# Altium schematic sheet current amplifier 02.SchDoc: PHOTOELECTRIC EFFECT
size A3; ApprovedBy: NHOPPASIT S.; CheckedBy: NHOPPASIT S.; Author: NHOPPASIT S.; DrawnBy: NHOPPASIT S.; DocumentNumber: EE-01; Revision: 1; SheetNumber: 1; SheetTotal: 1; Size: A3; PageSetup: Record=PageOptions?CenterHorizontal=True?CenterVertical=True?PrintScale=0.96?XCorrection=1.00?YCorrection=1.00?PrintKind=0?BorderSize=5000000?LeftOffset=0?BottomOffset=0?Orientation=2?PaperLength=1000?PaperWidth=1000?Scale=100?PaperSource=7?PrintQuality=-4?MediaType=1?DitherType=10?PaperKind=A4?PrintScaleMode=1; DocumentName: PHOTOELECTRIC EFFECT SCH; ProjectName: PHOTOELECTRIC EFFECT 01
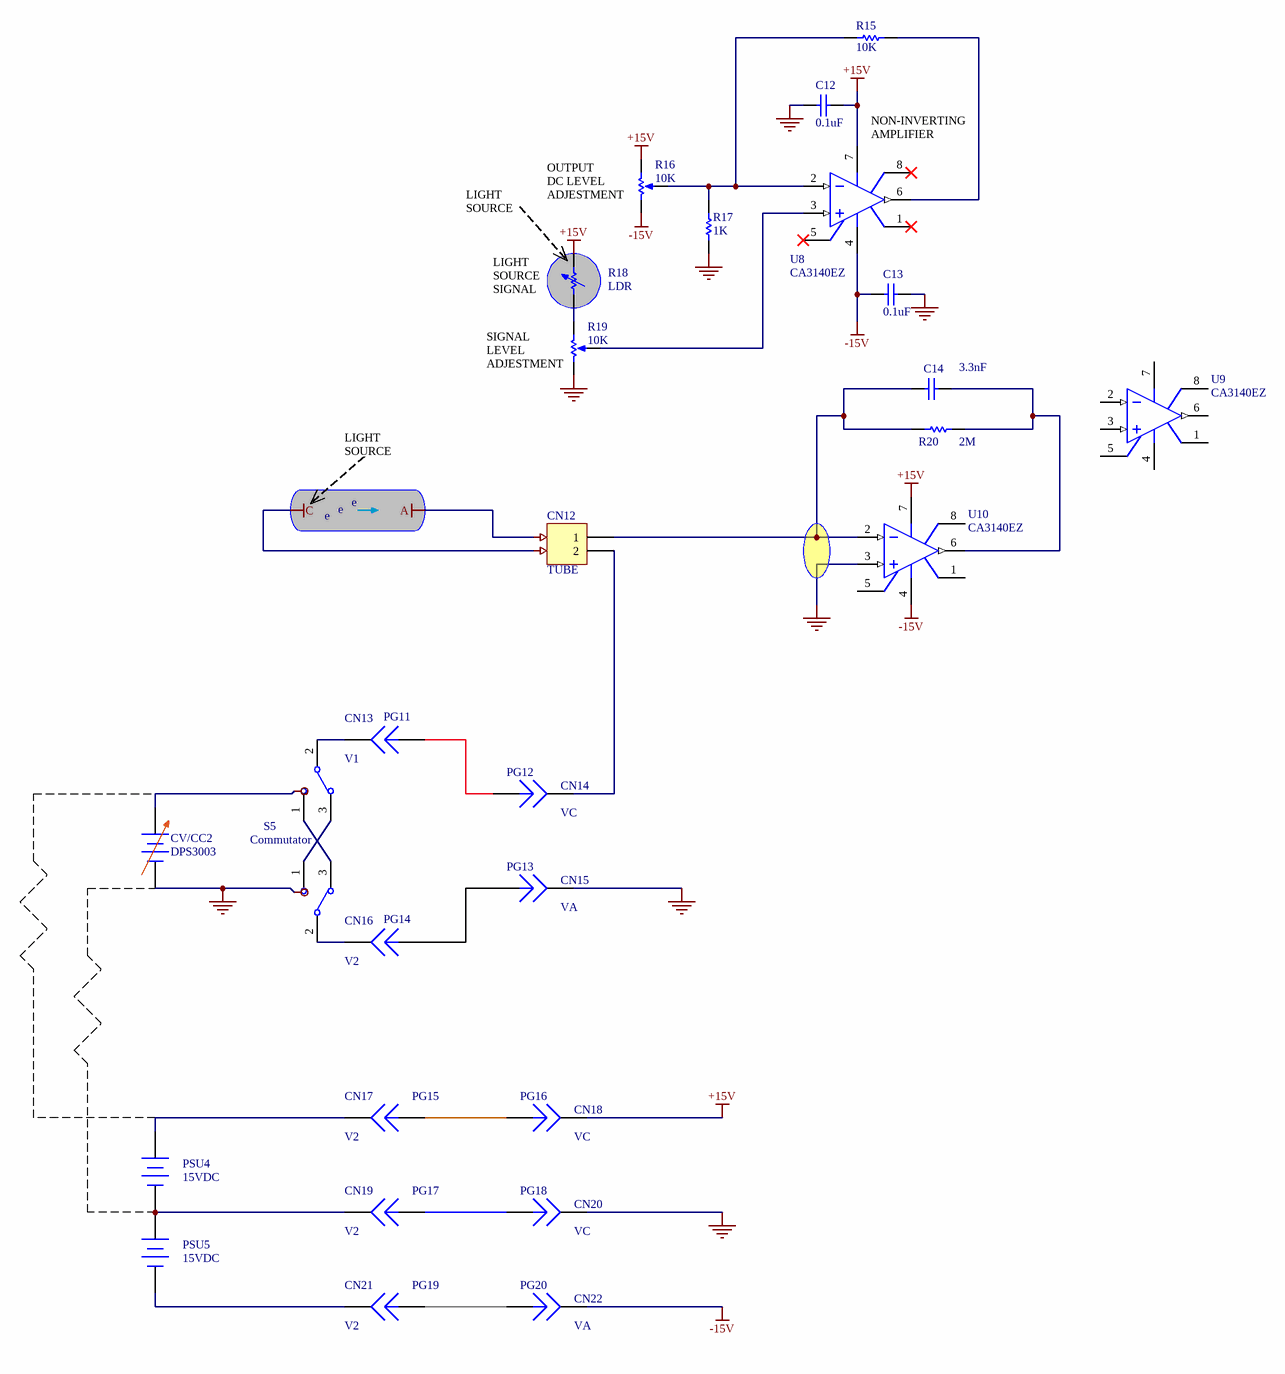
[diagram p0: current amplifier 02.SchDoc]

## Parts
C12  0.1uF  [RAD-0.3]
C13  0.1uF  [RAD-0.3]
C14  3.3nF  [RAD-0.3]
CN12  TUBE  [HDR1X2]
CN13  V1  [PIN1]
CN14  VC  [PIN1]
CN15  VA  [PIN1]
CN16  V2  [PIN1]
CN17  V2  [PIN1]
CN18  VC  [PIN1]
CN19  V2  [PIN1]
CN20  VC  [PIN1]
CN21  V2  [PIN1]
CN22  VA  [PIN1]
CV/CC2  DPS3003  [BAT-2]
PG11  Plug  [PIN1]  (value not drawn)
PG12  Plug  [PIN1]  (value not drawn)
PG13  Plug  [PIN1]  (value not drawn)
PG14  Plug  [PIN1]  (value not drawn)
PG15  Plug  [PIN1]  (value not drawn)
PG16  Plug  [PIN1]  (value not drawn)
PG17  Plug  [PIN1]  (value not drawn)
PG18  Plug  [PIN1]  (value not drawn)
PG19  Plug  [PIN1]  (value not drawn)
PG20  Plug  [PIN1]  (value not drawn)
PSU4  15VDC  [BAT-2]
PSU5  15VDC  [BAT-2]
R15  10K  [AXIAL-0.3]
R16  10K  [VR5]
R17  1K  [AXIAL-0.3]
R18  LDR  [AXIAL-0.7]
R19  10K  [VR5]
R20  2M  [AXIAL-0.3]
S5  Commutator  [TL36WW15050]
S6  SW-SPDT  [TL36WW15050]  (value not drawn)
U8  CA3140EZ  [H-08A]
U9  CA3140EZ  [H-08A]
U10  CA3140EZ  [H-08A]

## Nets
+15V: C12.2 CN18.1 R16.1(TOP) R18.2 U8.7(V+) U10.7(V+)
-15V: C13.1 CN22.1 R16.2(BOT) U8.4(V-) U10.4(V-)
A: C12.1 C13.2 CN15.1 CN20.1 CV/CC2.1(+) CV/CC2.2(-) R17.1 R19.2(BOT) U10.3(IN+)  [also labelled C, GND, VCC]
NetC14_1: C14.1 CN12.1 R20.1 U10.2(IN-)
NetC14_2: C14.2 R20.2 U10.6(OUT)
NetCN12_2: CN12.2 CN14.1
NetCN13_1: CN13.1 S5.2
NetCN16_1: CN16.1 S6.2
NetCN17_1: CN17.1 PSU4.1(+)
NetCN19_1: CN19.1 PSU4.2(-) PSU5.1(+)
NetCN21_1: CN21.1 PSU5.2(-)
NetPG11_1: PG11.1 PG12.1
NetPG13_1: PG13.1 PG14.1
NetPG15_1: PG15.1 PG16.1
NetPG17_1: PG17.1 PG18.1
NetPG19_1: PG19.1 PG20.1
NetR15_1: R15.1 R16.3(TAP) R17.2 U8.2(IN-)
NetR15_2: R15.2 U8.6(OUT)
NetR18_1: R18.1 R19.1(TOP)
NetR19_3: R19.3(TAP) U8.3(IN+)
NetS5_1: S5.1 S6.3
NetS5_3: S5.3 S6.1

Not connected (* = marked no-connect by the designer): U8 1(OS_NUL)* 5(OS_NUL)* 8(TAB)*; U9 1(OS_NUL) 2(IN-) 3(IN+) 4(V-) 5(OS_NUL) 6(OUT) 7(V+) 8(TAB); U10 1(OS_NUL) 5(OS_NUL) 8(TAB)

## Notes on the sheet
- NON-INVERTING
  AMPLIFIER
- LIGHT SOURCE
- (near R16) OUTPUT
  DC LEVEL
  ADJESTMENT
- (near R18) LIGHT SOURCE
  SIGNAL
- (near R19) SIGNAL
  LEVEL
  ADJESTMENT
- e
- Title:
- Date:
- Draw By:
- Size:
- File:
- Approve By:

## Library data of the parts
C12-C14 = Cap: Capacitor; Published: 8-Jun-2000; LatestRevisionDate: 17-Jul-2002; LatestRevisionNote: Re-released for DXP Platform.; PackageReference: RAD-0.3; Publisher: Altium Limited; PackageDescription: Radial Cap, Thru-Hole; 2 Leads; 0.3 in Pin Spacing
  C12 C13: Value: 0.1uF
  C14: Value: 3.3nF
CN12 = Header 2: Header, 2-Pin; LatestRevisionDate: 17-Jul-2002; LatestRevisionNote: Re-released for DXP Platform.; Publisher: Altium Limited
CN13-CN22 = Socket: LatestRevisionDate: 17-Jul-2002; LatestRevisionNote: Re-released for DXP Platform.; Publisher: Altium Limited
CV/CC2 PSU4 PSU5 = Battery: Multicell Battery; Published: 24-Mar-1999; LatestRevisionDate: 17-Jul-2002; LatestRevisionNote: Re-released for DXP Platform.; PackageReference: BAT-2; Publisher: Altium Limited; PackageDescription: Battery; 2 Leads
R15 R17 R20 = Res1: Resistor; Published: 8-Jun-2000; LatestRevisionDate: 17-Jul-2002; LatestRevisionNote: Re-released for DXP Platform.; PackageReference: AXIAL-0.3; Publisher: Altium Limited; PackageDescription: Axial Device, Thru-Hole; 2 Leads; 0.3 in Pin Spacing
  R15: Value: 10K
  R17: Value: 1K
  R20: Value: 2M
R16 R19 = RPot: Potentiometer; Sim Note: Enter the Resistance value and the set point into parameter fields.; Set Position: 0.5; Published: 8-Jun-2000; LatestRevisionDate: 17-Jul-2002; LatestRevisionNote: Re-released for DXP Platform.; PackageReference: VR5; Publisher: Altium Limited; PackageDescription: Variable Resistor, Thru-Hole; 3 Leads; Value: 10K
R18 = Res Adj1: Variable Resistor; Value: 1K; Set Position: 0.5; Published: 8-Jun-2000; LatestRevisionDate: 17-Jul-2002; LatestRevisionNote: Re-released for DXP Platform.; PackageReference: AXIAL-0.7; Publisher: Altium Limited; PackageDescription: Axial Device, Thru-Hole; 2 Leads; 0.7 in Pin Spacing
S5 S6 = SW-SPDT: SPDT Subminiature Toggle Switch, Right Angle Mounting, Vertical Actuation; Published: 24-Mar-1999; LatestRevisionDate: 17-Dec-2003; LatestRevisionNote: Schematic revised, PCB Footprint replaced.; DatasheetVersion: 05-Dec-2000; PackageReference: TL36WW15050; Publisher: Altium Limited; PackageDescription: Switch; 4 Leads; ComponentLink1Description: Manufacturer Link; ComponentLink1URL: http://www.apem.com
U8-U10 = Op Amp: FET Operational Amplifier; Published: 8-Jun-2000; LatestRevisionDate: 17-Jul-2002; LatestRevisionNote: Re-released for DXP Platform.; DatasheetVersion: REV. B; PackageVersion: 1990; PackageReference: H-08A; Publisher: Altium Limited; PackageDescription: Can; 8 Leads; Pin Circle Dia. 5.08 mm; Lead Dia. 0.53 mm (max); ComponentLink1Description: Manufacturer Link; ComponentLink1URL: http://www.analog.com/
PG11-PG20 = Plug: LatestRevisionDate: 17-Jul-2002; LatestRevisionNote: Re-released for DXP Platform.; Publisher: Altium Limited